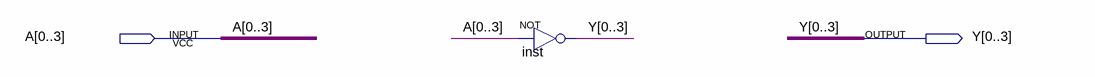
[diagram p0: schematic sheet]
// Quartus schematic BitwiseNot.bdf as structural Verilog: 1 symbols, 2 pins
module BitwiseNot (
  input  [0:3] A,
  output [0:3] Y
);

  assign Y = ~A;  // NOT inst, 4 bits wide
endmodule
